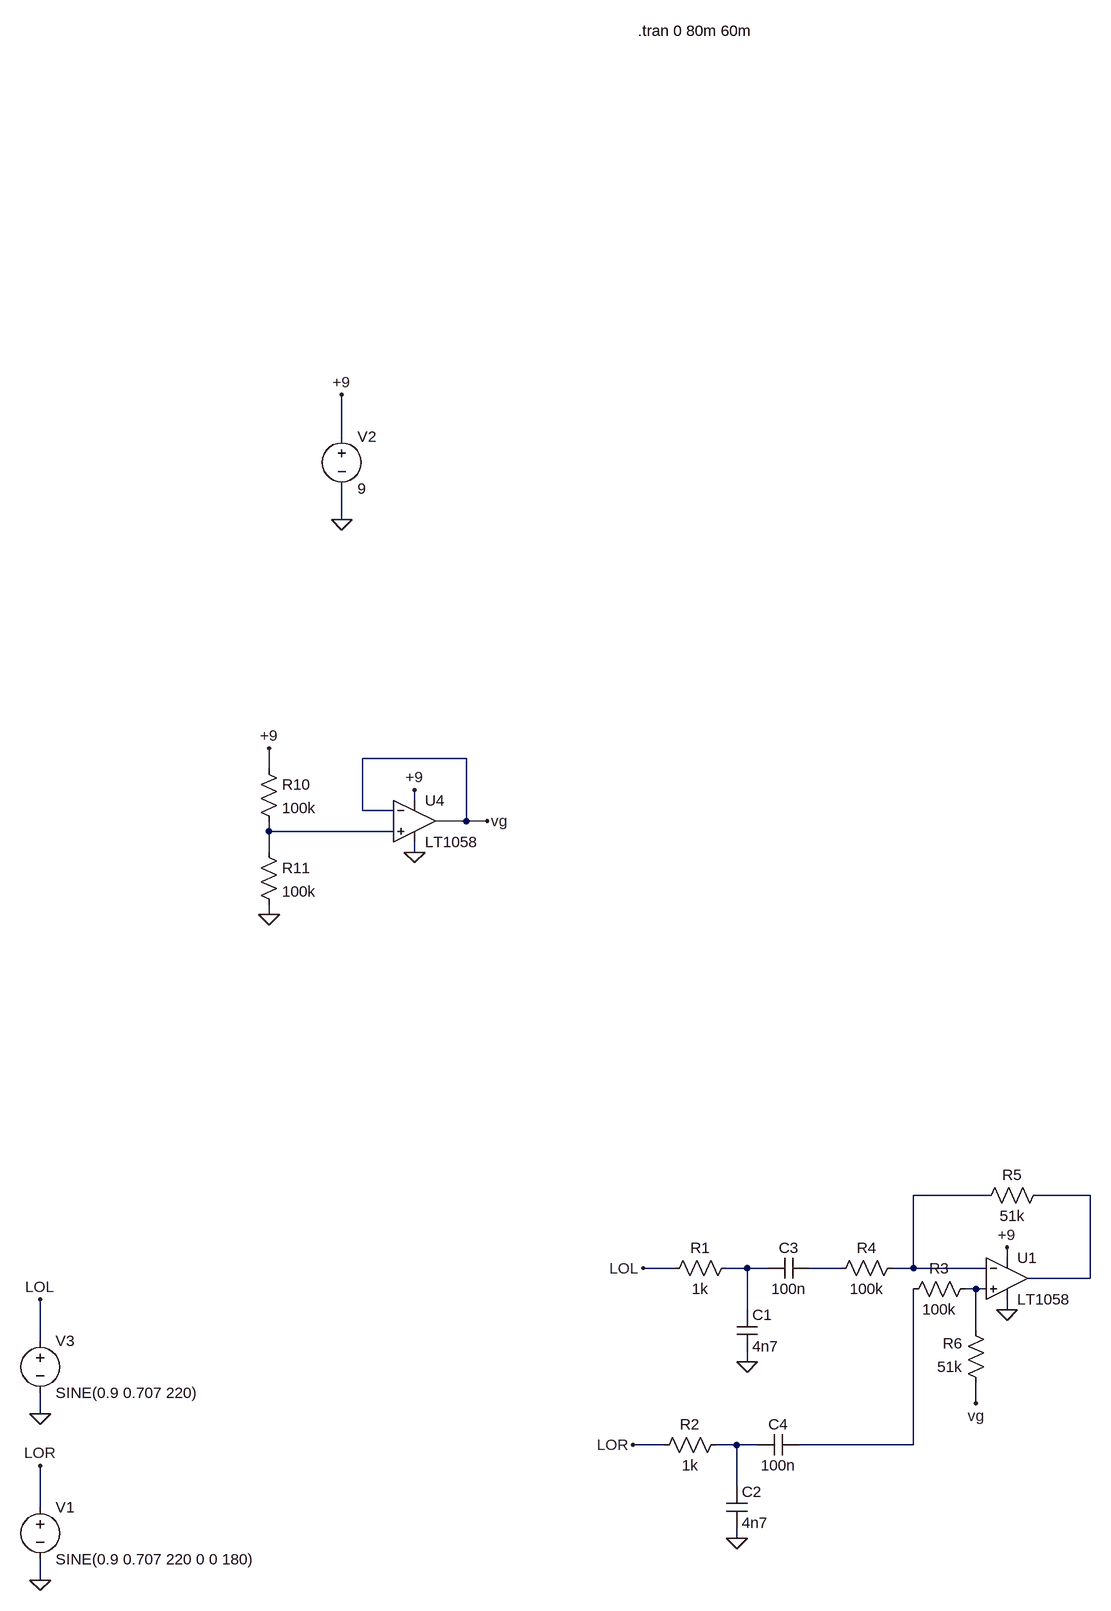
[diagram p0: schematic OutputStageSim.asc]
OutputStageSim.asc, the LTspice schematic file:
Version 4
SHEET 1 3420 3584
WIRE -496 736 -496 672
WIRE -496 864 -496 816
WIRE -304 1232 -464 1232
WIRE -608 1248 -608 1216
WIRE -384 1296 -384 1280
WIRE -464 1312 -464 1232
WIRE -416 1312 -464 1312
WIRE -304 1328 -304 1232
WIRE -304 1328 -352 1328
WIRE -272 1328 -304 1328
WIRE -608 1344 -608 1328
WIRE -416 1344 -608 1344
WIRE -608 1376 -608 1344
WIRE -384 1376 -384 1360
WIRE -608 1472 -608 1456
WIRE 496 1904 384 1904
WIRE 656 1904 576 1904
WIRE 528 2000 528 1984
WIRE 16 2016 -32 2016
WIRE 128 2016 96 2016
WIRE 160 2016 128 2016
WIRE 272 2016 224 2016
WIRE 384 2016 384 1904
WIRE 384 2016 352 2016
WIRE 496 2016 384 2016
WIRE 656 2032 656 1904
WIRE 656 2032 560 2032
WIRE 480 2048 464 2048
WIRE 496 2048 480 2048
WIRE 128 2080 128 2016
WIRE 528 2080 528 2064
WIRE 480 2112 480 2048
WIRE -960 2128 -960 2064
WIRE 128 2160 128 2144
WIRE 480 2224 480 2192
WIRE -960 2240 -960 2208
WIRE 0 2288 -48 2288
WIRE 112 2288 80 2288
WIRE 144 2288 112 2288
WIRE 384 2288 384 2048
WIRE 384 2288 208 2288
WIRE 112 2352 112 2288
WIRE -960 2384 -960 2320
WIRE 112 2432 112 2416
WIRE -960 2496 -960 2464
FLAG -496 672 +9
FLAG -496 864 0
FLAG -384 1280 +9
FLAG -384 1376 0
FLAG -272 1328 vg
FLAG -608 1472 0
FLAG -608 1216 +9
FLAG -960 2064 LOL
FLAG -960 2240 0
FLAG -960 2320 LOR
FLAG -960 2496 0
FLAG 128 2160 0
FLAG -32 2016 LOL
FLAG 112 2432 0
FLAG -48 2288 LOR
FLAG 528 1984 +9
FLAG 528 2080 0
FLAG 480 2224 vg
SYMBOL voltage -496 720 R0
SYMATTR InstName V2
SYMATTR Value 9
SYMBOL OpAmps/LT1058 -384 1264 R0
SYMATTR InstName U4
SYMBOL res -624 1232 R0
SYMATTR InstName R10
SYMATTR Value 100k
SYMBOL res -624 1360 R0
SYMATTR InstName R11
SYMATTR Value 100k
SYMBOL voltage -960 2112 R0
SYMATTR InstName V3
SYMATTR Value SINE(0.9 0.707 220)
SYMBOL voltage -960 2368 R0
SYMATTR InstName V1
SYMATTR Value SINE(0.9 0.707 220 0 0 180)
SYMBOL res 112 2000 R90
WINDOW 0 0 56 VBottom 2
WINDOW 3 32 56 VTop 2
SYMATTR InstName R1
SYMATTR Value 1k
SYMBOL cap 112 2080 R0
SYMATTR InstName C1
SYMATTR Value 4n7
SYMBOL res 96 2272 R90
WINDOW 0 0 56 VBottom 2
WINDOW 3 32 56 VTop 2
SYMATTR InstName R2
SYMATTR Value 1k
SYMBOL cap 96 2352 R0
SYMATTR InstName C2
SYMATTR Value 4n7
SYMBOL OpAmps/LT1058 528 1968 R0
SYMATTR InstName U1
SYMBOL res 480 2032 R90
WINDOW 0 0 56 VBottom 2
WINDOW 3 32 56 VTop 2
SYMATTR InstName R3
SYMATTR Value 100k
SYMBOL res 368 2000 R90
WINDOW 0 0 56 VBottom 2
WINDOW 3 32 56 VTop 2
SYMATTR InstName R4
SYMATTR Value 100k
SYMBOL res 592 1888 R90
WINDOW 0 0 56 VBottom 2
WINDOW 3 32 56 VTop 2
SYMATTR InstName R5
SYMATTR Value 51k
SYMBOL res 496 2208 R180
WINDOW 0 36 76 Left 2
WINDOW 3 36 40 Left 2
SYMATTR InstName R6
SYMATTR Value 51k
SYMBOL cap 224 2000 R90
WINDOW 0 0 32 VBottom 2
WINDOW 3 32 32 VTop 2
SYMATTR InstName C3
SYMATTR Value 100n
SYMBOL cap 208 2272 R90
WINDOW 0 0 32 VBottom 2
WINDOW 3 32 32 VTop 2
SYMATTR InstName C4
SYMATTR Value 100n
TEXT -40 112 Left 2 !.tran 0 80m 60m

The netlist it stands for:
* OutputStageSim.asc
V2 +9 0 9
XU4 N001 vg +9 0 vg LT1057  ; LT1058, pins In+ In- V+ V- OUT
R10 +9 N001 100k
R11 N001 0 100k
V3 LOL 0 SINE(0.9 0.707 220)
V1 LOR 0 SINE(0.9 0.707 220 0 0 180)
R1 N004 LOL 1k
C1 N004 0 4n7
R2 N007 LOR 1k
C2 N007 0 4n7
XU1 N006 N002 +9 0 N003 LT1057  ; LT1058, pins In+ In- V+ V- OUT
R3 N006 N008 100k
R4 N002 N005 100k
R5 N003 N002 51k
R6 vg N006 51k
C3 N005 N004 100n
C4 N008 N007 100n
.tran 0 80m 60m
.lib LTC.lib
.backanno
.end